# Altium project BugBuster_DAQ.PrjPcb (part 2 of 3)
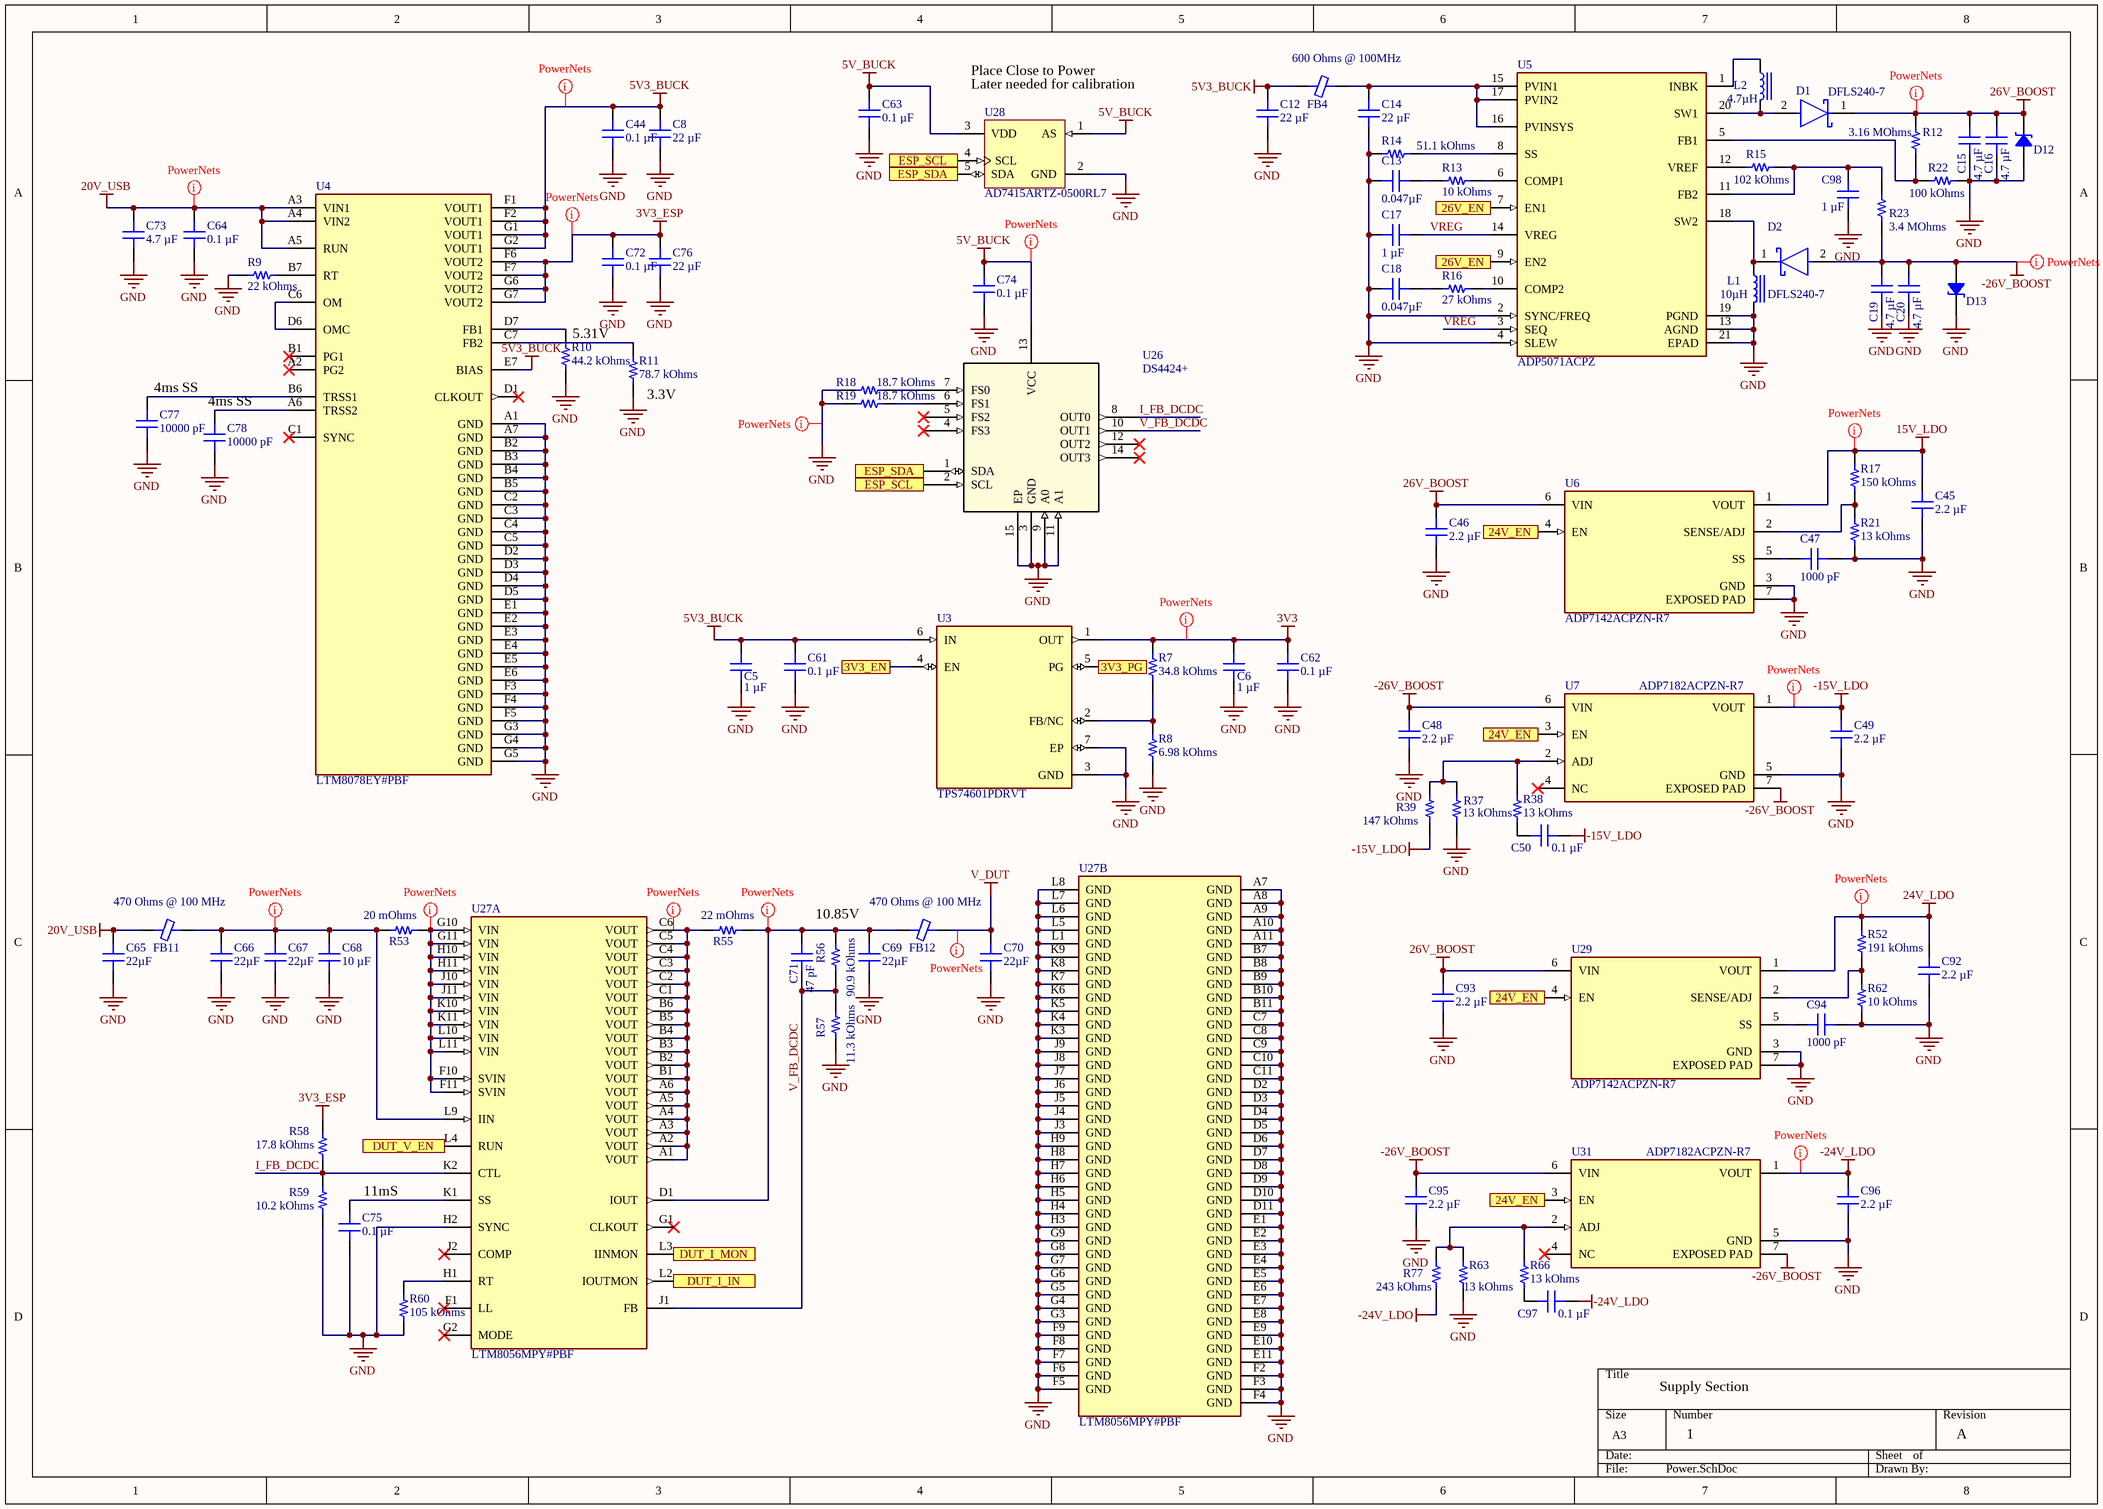
[diagram p6: Power.SchDoc]

## Sheet Power.SchDoc (continued)
### Library data of the parts
C5 C6 C17 C98 = GMC10X7R105M50NT: SMT Capacitor; manufacturer: Cal-Chip Electronics, Inc.; Temperature Coefficient: X7R; Tolerance: ±20%; Voltage - Rated: 50V; Part Number: GMC10X7R105M50NT; Applications: General Purpose; Capacitance: 1 µF; componentlink1description: Datasheet; componentlink1url: https://calchip.com/wp-content/uploads/2024/02/gmc_series-1.pdf; componentlink2description: DigiKey Link; componentlink2url: https://www.digikey.com/en/products/detail/cal-chip-electronics-inc/GMC10X7R105M50NT/25323876; Device Package: 0603 (1608 Metric); lastupdated: 06/04/2026 19:17:52; Lifecycle Status: Active; Minimum Order: 1; Mounting Type: Surface Mount, MLCC; Operating Temperature: -55°C ~ 125°C; Package / Case: 0603 (1608 Metric); packaging: TapeAndReel; partid: 65934; price: 0.06; series: GMC; Size / Dimension: 0.063" L x 0.031" W (1.60mm x 0.80mm); Supplier 1: DigiKey; Supplier Part Number 1: 4713-GMC10X7R105M50NTCT-ND; Thickness (Max): 0.037" (0.95mm); value: 1 µF
C8 C12 C14 C76 = GRM188C61C226ME01D: SMT Capacitor; manufacturer: Murata Electronics; Temperature Coefficient: X5S; Tolerance: ±20%; Voltage - Rated: 16V; Part Number: GRM188C61C226ME01D; value: 22 µF; Applications: General Purpose; Capacitance: 22 µF; componentlink1description: Datasheet; componentlink1url: https://search.murata.co.jp/Ceramy/image/img/A01X/G101/ENG/GRM188C61C226ME01-01A.pdf; componentlink2description: DigiKey Link; componentlink2url: https://www.digikey.com/en/products/detail/murata-electronics/GRM188C61C226ME01D/22528395; Device Package: 0603 (1608 Metric); lastupdated: 06/04/2026 19:18:15; Lifecycle Status: Active; Minimum Order: 1; Mounting Type: Surface Mount, MLCC; Operating Temperature: -55°C ~ 85°C; Package / Case: 0603 (1608 Metric); packaging: TapeAndReel; partid: 60294; price: 0.08; series: GRM; Size / Dimension: 0.063" L x 0.031" W (1.60mm x 0.80mm); Supplier 1: DigiKey; Supplier Part Number 1: 490-GRM188C61C226ME01DCT-ND; Thickness (Max): 0.039" (1.00mm)
C13 C18 = C0603C473K3RACAUTO: CAP CER 0.047UF 25V X7R 0603; manufacturer: KEMET; Capacitance: 0.047 ÂµF; Tolerance: Â±10%; Applications: Automotive Bypass Decoupling; componentlink1description: Datasheet; componentlink1url: https://api.kemet.com/component-edge/download/datasheet/C0603C473K3RACAUTO.pdf; componentlink2description: DigiKey Link; componentlink2url: https://www.digikey.com/en/products/detail/kemet/C0603C473K3RACAUTO/3314894; Device Package: 0603 (1608 Metric); lastupdated: 2026-04-06 19:23:51.997000; Lifecycle Status: Active; Part Number: C0603C473K3RACAUTO; Minimum Order: 1; Mounting Type: Surface Mount MLCC; Operating Temperature: -55Â°C ~ 125Â°C; Package / Case: 0603 (1608 Metric); packaging: TapeAndReel; partid: 2309; Part Status: Active; price: 0.01; Ratings: AEC-Q200; series: SMD Auto X7R; Size / Dimension: 0.063\ L x 0.031\ W (1.60mm x 0.80mm); Supplier 1: DigiKey; Supplier Part Number 1: 399-6899-1-ND; Temperature Coefficient: X7R; Thickness (Max): 0.035\ (0.90mm); value: 0.047µF; Voltage - Rated: 25V
C15 C16 C19 C20 = CGA4J1X7R1H475K125AC: CAP CER 4.7UF 50V X7R 0805; manufacturer: TDK Corporation; Tolerance: ±10%; Applications: Automotive; Capacitance: 4.7 µF; componentlink1description: Datasheet; componentlink1url: https://product.tdk.com/info/en/catalog/datasheets/mlcc_automotive_general_en.pdf?ref_disty=digikey; componentlink2description: DigiKey Link; componentlink2url: https://www.digikey.com/en/products/detail/tdk-corporation/CGA4J1X7R1H475K125AC/9742505; Device Package: 0805 (2012 Metric); Features: Low ESL; lastupdated: 2026-04-06 19:32:49.667000; Lifecycle Status: Active; Part Number: CGA4J1X7R1H475K125AC; Minimum Order: 1; Mounting Type: Surface Mount MLCC; Operating Temperature: -55°C ~ 125°C; Package / Case: 0805 (2012 Metric); packaging: TapeAndReel; partid: 44448; Part Status: Active; price: 0.12; Ratings: AEC-Q200; series: CGA; Size / Dimension: 0.079\ L x 0.049\ W (2.00mm x 1.25mm); Supplier 1: DigiKey; Supplier Part Number 1: 445-181404-1-ND; Temperature Coefficient: X7R; Thickness (Max): 0.059\ (1.50mm); value: 4.7 µF; Voltage - Rated: 50V
C44 C50 C61-C64 C72 C74 C75 C97 = C0603C104M5RACTU: SMT Capacitor; manufacturer: KEMET; Temperature Coefficient: X7R; Tolerance: ±20%; Voltage - Rated: 50V; Part Number: C0603C104M5RACTU; value: 0.1 µF; Applications: Bypass, Decoupling; Capacitance: 0.1 µF; componentlink1description: Datasheet; componentlink1url: https://api.kemet.com/component-edge/download/datasheet/C0603C104M5RACTU.pdf; componentlink2description: DigiKey Link; componentlink2url: https://www.digikey.com/en/products/detail/kemet/C0603C104M5RACTU/2199782; Device Package: 0603 (1608 Metric); lastupdated: 06/04/2026 19:22:47; Lifecycle Status: Active; Minimum Order: 1; Mounting Type: Surface Mount, MLCC; Operating Temperature: -55°C ~ 125°C; Package / Case: 0603 (1608 Metric); packaging: CutTape; partid: 69106; Part Status: Active; price: 0.01; series: SMD Comm X7R; Size / Dimension: 0.063" L x 0.031" W (1.60mm x 0.80mm); Supplier 1: DigiKey; Supplier Part Number 1: 399-C0603C104M5RACTUCT-ND; Thickness (Max): 0.034" (0.87mm)
C45 C46 C48 C49 C92 C93 C95 C96 = UMK212BB7225KG-T: SMT Capacitor; manufacturer: Taiyo Yuden; Temperature Coefficient: X7R; Tolerance: ±10%; Voltage - Rated: 50V; Part Number: UMK212BB7225KG-T; value: 2.2 µF; Applications: SMPS Filtering; Capacitance: 2.2 µF; componentlink1description: Datasheet; componentlink1url: https://www.yuden.co.jp/productdata/catalog/mlcc01_e.pdf; componentlink2description: DigiKey Link; componentlink2url: https://www.digikey.com/en/products/detail/taiyo-yuden/UMK212BB7225KG-T/3194965; Device Package: 0805 (2012 Metric); lastupdated: 06/04/2026 19:33:11; Lifecycle Status: Active; Minimum Order: 1; Mounting Type: Surface Mount, MLCC; Operating Temperature: -55°C ~ 125°C; Package / Case: 0805 (2012 Metric); packaging: TapeAndReel; partid: 45972; Part Status: Active; price: 0.06; series: M; Size / Dimension: 0.079" L x 0.049" W (2.00mm x 1.25mm); Supplier 1: DigiKey; Supplier Part Number 1: 587-3169-1-ND; Thickness (Max): 0.057" (1.45mm)
C47 C94 = GCJ188R71E102KA01D: CAP CER 1000PF 25V X7R 0603; manufacturer: Murata Electronics; Tolerance: ±10%; Applications: Automotive Boardflex Sensitive; Capacitance: 1000 pF; componentlink1description: Datasheet; componentlink1url: https://search.murata.co.jp/Ceramy/image/img/A01X/G101/ENG/GCJ188R71E102KA01-01.pdf; componentlink2description: DigiKey Link; componentlink2url: https://www.digikey.com/en/products/detail/murata-electronics/GCJ188R71E102KA01D/7363222; Device Package: 0603 (1608 Metric); Features: Soft Termination; lastupdated: 2026-04-06 19:23:52.667000; Lifecycle Status: Active; Part Number: GCJ188R71E102KA01D; Minimum Order: 1; Mounting Type: Surface Mount MLCC; Operating Temperature: -55°C ~ 125°C; Package / Case: 0603 (1608 Metric); packaging: TapeAndReel; partid: 2177; Part Status: Active; price: 0.01; Ratings: AEC-Q200; series: GCJ; Size / Dimension: 0.063\ L x 0.031\ W (1.60mm x 0.80mm); Supplier 1: DigiKey; Supplier Part Number 1: 490-16478-1-ND; Temperature Coefficient: X7R; Thickness (Max): 0.035\ (0.90mm); value: 1000 pF; Voltage - Rated: 25V
C65-C67 C69 C70 = CGA9P3X7R1H226M250KB: CAP 2220 X7R 50V 22UF 20% 2.50MM; manufacturer: TDK Corporation; Applications: Automotive; Capacitance: 22µF; componentlink1description: Datasheet; componentlink1url: https://product.tdk.com/info/en/catalog/datasheets/mlcc_automotive_general_en.pdf?ref_disty=digikey; componentlink2description: DigiKey Link; componentlink2url: http://digikey.com/product-detail/en/tdk-corporation/CGA9P3X7R1H226M250KB/445-181650-1-ND/10240637; Device Package: 2220 (5750 Metric); Features: Low ESL; lastupdated: 2020-09-02 01:11:23.223000; Lifecycle Status: Active; Part Number: CGA9P3X7R1H226M250KB; Minimum Order: 1; Mounting Type: Surface Mount MLCC; Operating Temperature: -55°C ~ 125°C; Package / Case: 2220 (5750 Metric); packaging: TapeAndReel; Part Status: Active; price: 5.78; Ratings: AEC-Q200; series: CGA; Size / Dimension: 0.224\ L x 0.197\ W (5.70mm x 5.00mm); Supplier 1: DigiKey; Supplier Part Number 1: 445-181650-1-ND; Temperature Coefficient: X7R; Thickness (Max): 0.110\ (2.80mm); Tolerance: ±20%; value: 22µF; Voltage - Rated: 50V
C68 = 1210B106K500CT: CAP CER 10UF 50V X7R 1210; manufacturer: Walsin Technology Corporation; Tolerance: ±10%; Applications: General Purpose; Capacitance: 10 µF; componentlink1description: Datasheet; componentlink1url: https://www.passivecomponent.com/wp-content/uploads/datasheet/WTC_MLCC_General_Purpose.pdf; componentlink2description: DigiKey Link; componentlink2url: https://www.digikey.com/en/products/detail/walsin-technology-corporation/1210B106K500CT/15987744; Device Package: 1210 (3225 Metric); lastupdated: 2026-04-06 19:45:06.543000; Lifecycle Status: Active; Part Number: 1210B106K500CT; Minimum Order: 1; Mounting Type: Surface Mount MLCC; Operating Temperature: -55°C ~ 125°C; Package / Case: 1210 (3225 Metric); packaging: TapeAndReel; partid: 78364; price: 0.07; series: -; Size / Dimension: 0.126\ L x 0.098\ W (3.20mm x 2.50mm); Supplier 1: DigiKey; Supplier Part Number 1: 1292-1210B106K500CT-ND; Temperature Coefficient: X7R; Thickness (Max): 0.110\ (2.80mm); value: 10 µF; Voltage - Rated: 50V
C71 = CC0603KRNPO9BN470: CAP CER 47PF 50V C0G/NPO 0603; manufacturer: Yageo; Temperature Coefficient: C0G NP0; Tolerance: ±10%; Applications: General Purpose; Capacitance: 47 pF; componentlink1description: Datasheet; componentlink1url: https://www.yageo.com/upload/media/product/productsearch/datasheet/mlcc/UPY-GP_NP0_16V-to-50V_17.pdf; componentlink2description: DigiKey Link; componentlink2url: https://www.digikey.com/en/products/detail/yageo/CC0603KRNPO9BN470/5883714; Device Package: 0603 (1608 Metric); lastupdated: 2026-04-06 19:23:26.303000; Lifecycle Status: Active; Part Number: CC0603KRNPO9BN470; Minimum Order: 1; Mounting Type: Surface Mount MLCC; Operating Temperature: -55°C ~ 125°C; Package / Case: 0603 (1608 Metric); packaging: TapeAndReel; partid: 9442; Part Status: Active; price: 0.01; series: CC; Size / Dimension: 0.063\ L x 0.031\ W (1.60mm x 0.80mm); Supplier 1: DigiKey; Supplier Part Number 1: 311-4037-1-ND; Thickness (Max): 0.035\ (0.90mm); value: 47 pF; Voltage - Rated: 50V
C73 = GRM21BZ7YA475KE15K: CAP CER 4.7UF 35V X7R 0805; manufacturer: Murata Electronics; Tolerance: ±10%; Applications: General Purpose; Capacitance: 4.7 µF; componentlink1description: Datasheet; componentlink1url: https://search.murata.co.jp/Ceramy/image/img/A01X/G101/ENG/GRM21BZ7YA475KE15-01.pdf; componentlink2description: DigiKey Link; componentlink2url: https://www.digikey.com/en/products/detail/murata-electronics/GRM21BZ7YA475KE15K/13904872; Device Package: 0805 (2012 Metric); lastupdated: 2026-04-06 19:31:47.907000; Lifecycle Status: Active; Part Number: GRM21BZ7YA475KE15K; Minimum Order: 1; Mounting Type: Surface Mount MLCC; Operating Temperature: -55°C ~ 125°C; Package / Case: 0805 (2012 Metric); packaging: TapeAndReel; partid: 42428; Part Status: Active; price: 0.05; series: GRM; Size / Dimension: 0.079\ L x 0.049\ W (2.00mm x 1.25mm); Supplier 1: DigiKey; Supplier Part Number 1: 490-GRM21BZ7YA475KE15KCT-ND; Temperature Coefficient: X7R; Thickness (Max): 0.057\ (1.45mm); value: 4.7 µF; Voltage - Rated: 35V
C77 C78 = AC0603KRX7R0BB103: CAP CER 10000PF 100V X7R 0603; manufacturer: Yageo; Tolerance: ±10%; Applications: Automotive; Capacitance: 10000 pF; componentlink1description: Datasheet; componentlink1url: http://www.yageo.com/NewPortal/_en/search/productDocs.jsp?YageoPartNumber=AC0603KRX7R0BB103; componentlink2description: DigiKey Link; componentlink2url: https://www.digikey.com/en/products/detail/yageo/AC0603KRX7R0BB103/6643086; Device Package: 0603 (1608 Metric); lastupdated: 2026-04-06 19:23:52.473000; Lifecycle Status: Active; Part Number: AC0603KRX7R0BB103; Minimum Order: 1; Mounting Type: Surface Mount MLCC; Operating Temperature: -55°C ~ 125°C; Package / Case: 0603 (1608 Metric); packaging: TapeAndReel; partid: 2218; Part Status: Active; price: 0.01; Ratings: AEC-Q200; series: AC; Size / Dimension: 0.063\ L x 0.031\ W (1.60mm x 0.80mm); Supplier 1: DigiKey; Supplier Part Number 1: 311-3100-1-ND; Temperature Coefficient: X7R; Thickness (Max): 0.035\ (0.90mm); value: 10000 pF; Voltage - Rated: 100V
D1 D2 = CMP-12790-000037-1: DIODE SCHOTTKY 40V 2A POWERDI123; Manufacturer: Diodes Inc.; Peak Reverse Current: 20uA; Max Junction Temp: +125°C; Capacitance: 28pF; Max Surge Forward Current: 40A; Value: 28pF; Digikey Description: DIODE SCHOTTKY 40V 2A POWERDI123; Lead Free: Yes; Temperature Range Low: -65°C; ComponentLink2Description: Datasheet; Height: 1mm; Max Repetitive Reverse Voltage: 40V; Forward Current: 2A; Mouser Description: Schottky Diodes & Rectifiers 2.0A 40V; RoHS: TRUE; Device Class L3: Schottky Diodes; Footprint Url: https://www.diodes.com/assets/Package-Files/PowerDI123.pdf; Reverse Voltage: 40V; Package: PowerDI123; Manufacturer Part Number: DFLS240-7; Automotive: No; Device Class L1: Discrete Semiconductors; Temperature: -65°C to +125°C; Octopart: https://octopart.com/dfls240-7-diodes+inc.-9289682; Category: Diode; Temperature Range High: +125°C; ComponentLink2URL: https://www.diodes.com/assets/Package-Files/PowerDI123.pdf; Device Class L2: Diodes
D12 D13 = BZT52C27-7-F: DIODE ZENER 27V 500MW SOD123; Manufacturer: Diodes Incorporated; Current - Reverse Leakage @ Vr: 100 nA @ 18.9 V; Impedance (Max) (Zzt): 80 Ohms; Tolerance: ±7%; Voltage - Forward (Vf) (Max) @ If: 900 mV @ 10 mA; Part Number: BZT52C27-7-F; ComponentLink1Description: Datasheet; ComponentLink1URL: https://www.diodes.com/assets/Datasheets/ds18004.pdf; ComponentLink2Description: DigiKey Link; ComponentLink2URL: https://www.digikey.com/en/products/detail/diodes-incorporated/BZT52C27-7-F/815014; LastUpdated: 05/04/2026 20:32:36; Lifecycle Status: Active; Minimum Order: 1; Mounting Type: Surface Mount; Operating Temperature: -65°C ~ 150°C; Package / Case: SOD-123; Packaging: TapeAndReel; PartId: 1914; Part Status: Active; Power - Max: 500 mW; Price: 0.02; Series: -; Supplier 1: DigiKey; Supplier Part Number 1: BZT52C27-FDICT-ND; Supplier Device Package: SOD-123; Voltage - Zener (Nom) (Vz): 27 V
FB4 = BBPY00201209601Y00: EMI BEAD FILETER; Manufacturer: Chilisin Electronics; Current Rating (Max): 2A; DC Resistance (DCR) (Max): 100mOhm; Number of Lines: 1; Part Number: BBPY00201209601Y00; ComponentLink1Description: Datasheet; ComponentLink1URL: https://www.chilisin.com/upload/media/product/emi_bead/file/BBPY_Series.pdf; ComponentLink2Description: DigiKey Link; ComponentLink2URL: http://digikey.com/product-detail/en/chilisin-electronics/BBPY00201209601Y00/2184-BBPY00201209601Y00CT-ND/10498864; Device Package: 0805 (2012 Metric); Impedance @ Frequency: 600 Ohms @ 100MHz; LastUpdated: 05/04/2026 20:28:59; Lifecycle Status: Active; Minimum Order: 1; Mounting Type: Surface Mount; Operating Temperature: -55°C ~ 125°C; Package / Case: 0805 (2012 Metric); Packaging: Unknown; PartId: 1846; Part Status: Active; Price: 0.02; Series: *; Supplier 1: DigiKey; Supplier Part Number 1: 2184-BBPY00201209601Y00CT-ND; Value: 600 Ohms @ 100MHz
FB11 FB12 = BLM31KN471SN1L: FERRITE BEAD 470 OHM 1206 1LN; Manufacturer: Murata Electronics; Current Rating (Max): 4A; DC Resistance (DCR) (Max): 20mOhm; Filter Type: Power Line; Number of Lines: 1; Part Number: BLM31KN471SN1L; ComponentLink1Description: Datasheet; ComponentLink1URL: https://www.murata.com/en-global/products/productdata/8796739698718/ENFA0006.pdf; ComponentLink2Description: DigiKey Link; ComponentLink2URL: https://www.digikey.com/en/products/detail/murata-electronics/BLM31KN471SN1L/7564095; Device Package: 1206 (3216 Metric); Height (Max): 0.071" (1.80mm); Impedance @ Frequency: 470 Ohms @ 100 MHz; LastUpdated: 05/04/2026 20:29:27; Lifecycle Status: Active; Minimum Order: 1; Mounting Type: Surface Mount; Operating Temperature: -55°C ~ 125°C; Package / Case: 1206 (3216 Metric); Packaging: TapeAndReel; PartId: 1689; Part Status: Active; Price: 0.10; Series: BLM; Size / Dimension: 0.126" L x 0.063" W (3.20mm x 1.60mm); Supplier 1: DigiKey; Supplier Part Number 1: 490-16530-1-ND; Value: 470 Ohms @ 100 MHz
L1 = DFE252010F-100M=P2: FIXED IND 10UH 900MA 600 MOHM; Manufacturer: Murata Electronics; Current - Saturation: 1.5A; DC Resistance (DCR): 600mOhm Max; Inductance Frequency - Test: 1MHz; Material - Core: Iron Powder; Shielding: Shielded; Tolerance: ±20%; Part Number: DFE252010F-100M=P2; ComponentLink1Description: Datasheet; ComponentLink1URL: https://search.murata.co.jp/Ceramy/image/img/P02/J(E)TE243A-0012_DFE252010F_reference.pdf; ComponentLink2Description: DigiKey Link; ComponentLink2URL: http://digikey.com/product-detail/en/murata-electronics/DFE252010F-100M=P2/490-13039-1-ND/5812751; Current Rating (Amps): 900mA; Device Package: 1008 (2520 Metric); Height - Seated (Max): 0.039" (1.00mm); Inductance: 10µH; LastUpdated: 02/09/2020 01:29:31; Lifecycle Status: Active; Minimum Order: 1; Mounting Type: Surface Mount; Operating Temperature: -40°C ~ 125°C; Package / Case: 1008 (2520 Metric); Packaging: TapeAndReel; PartId: 3494; Part Status: Active; Price: 0.23; Series: DFE252010F; Size / Dimension: 0.098" L x 0.079" W (2.50mm x 2.00mm); Supplier 1: DigiKey; Supplier Part Number 1: 490-13039-1-ND; Value: 10µH
L2 = LPWI252010S4R7T: FIXED IND 4.7UH 1.5A 245MOHM SMD; Manufacturer: Littelfuse Inc.; Current - Saturation: 1.6A; DC Resistance (DCR): 245mOhm Max; Inductance Frequency - Test: 1MHz; Material - Core: Metal Composite; Shielding: Shielded; Tolerance: ±20%; Type: Thin Film; Part Number: LPWI252010S4R7T; ComponentLink1Description: Datasheet; ComponentLink1URL: //media.digikey.com/pdf/Data%20Sheets/Littelfuse%20PDFs/LPWI_Series_Rev2019_Prelim.pdf; ComponentLink2Description: DigiKey Link; ComponentLink2URL: http://digikey.com/product-detail/en/littelfuse-inc/LPWI252010S4R7T/F12114CT-ND/9996689; Current Rating (Amps): 1.5A; Device Package: 1008 (2520 Metric); Height - Seated (Max): 0.039" (1.00mm); Inductance: 4.7µH; LastUpdated: 05/04/2026 21:02:38; Lifecycle Status: Active; Minimum Order: 1; Mounting Type: Surface Mount; Operating Temperature: -40°C ~ 125°C; Package / Case: 1008 (2520 Metric); Packaging: TapeAndReel; PartId: 3510; Part Status: Active; Price: 0.30; Series: LPWI; Size / Dimension: 0.098" L x 0.079" W (2.50mm x 2.00mm); Supplier 1: DigiKey; Supplier Part Number 1: F12114CT-ND; Supplier Device Package: 1008; Value: 4.7µH
R7 = ERJ-3EKF3482V: RES SMD 34.8K OHM 1% 1/10W 0603; Manufacturer: Panasonic Electronic Components; Power (Watts): 0.1W, 1/10W; Temperature Coefficient: ±100ppm/°C; Part Number: ERJ-3EKF3482V; Value: 34.8 kOhms; ComponentLink1Description: Datasheet; ComponentLink1URL: https://industrial.panasonic.com/cdbs/www-data/pdf/RDA0000/AOA0000C304.pdf; ComponentLink2Description: DigiKey Link; ComponentLink2URL: https://www.digikey.com/en/products/detail/panasonic-electronic-components/ERJ-3EKF3482V/196306; Composition: Thick Film; Device Package: 0603 (1608 Metric); Features: Automotive AEC-Q200; Height - Seated (Max): 0.022" (0.55mm); LastUpdated: 09/02/2024 20:42:15; Lifecycle Status: Active; Minimum Order: 1; Number of Terminations: 2; Operating Temperature: -55°C ~ 155°C; Package / Case: 0603 (1608 Metric); Packaging: CutTape; PartId: 24039; Part Status: Active; Price: 0.01; Ratings: AEC-Q200; Resistance: 34.8 kOhms; Series: ERJ-3EK; Size / Dimension: 0.063" L x 0.031" W (1.60mm x 0.80mm); Supplier 1: DigiKey; Supplier Part Number 1: P34.8KHCT-ND; Supplier Device Package: 0603; Tolerance: ±1%
R8 = ERJ-3EKF6981V: RES SMD 6.98K OHM 1% 1/10W 0603; Manufacturer: Panasonic Electronic Components; Power (Watts): 0.1W, 1/10W; Temperature Coefficient: ±100ppm/°C; Part Number: ERJ-3EKF6981V; ComponentLink1Description: Datasheet; ComponentLink1URL: https://industrial.panasonic.com/cdbs/www-data/pdf/RDA0000/AOA0000C304.pdf; ComponentLink2Description: DigiKey Link; ComponentLink2URL: https://www.digikey.com/en/products/detail/panasonic-electronic-components/ERJ-3EKF6981V/196424; Composition: Thick Film; Device Package: 0603 (1608 Metric); Features: Automotive AEC-Q200; Height - Seated (Max): 0.022" (0.55mm); LastUpdated: 09/02/2024 20:42:22; Lifecycle Status: Active; Minimum Order: 1; Number of Terminations: 2; Operating Temperature: -55°C ~ 155°C; Package / Case: 0603 (1608 Metric); Packaging: TapeAndReel; PartId: 23131; Part Status: Active; Price: 0.01; Ratings: AEC-Q200; Resistance: 6.98 kOhms; Series: ERJ-3EK; Size / Dimension: 0.063" L x 0.031" W (1.60mm x 0.80mm); Supplier 1: DigiKey; Supplier Part Number 1: P6.98KHCT-ND; Supplier Device Package: 0603; Tolerance: ±1%; Value: 6.98 kOhms
R9 = ERJ-3EKF2202V: RES SMD 22K OHM 1% 1/10W 0603; Manufacturer: Panasonic Electronic Components; Power (Watts): 0.1W 1/10W; Temperature Coefficient: ±100ppm/°C; ComponentLink1Description: Datasheet; ComponentLink1URL: https://industrial.panasonic.com/cdbs/www-data/pdf/RDA0000/AOA0000C304.pdf; ComponentLink2Description: DigiKey Link; ComponentLink2URL: https://www.digikey.com/en/products/detail/panasonic-electronic-components/ERJ-3EKF2202V/1746336; Composition: Thick Film; Device Package: 0603 (1608 Metric); Features: Automotive AEC-Q200; Height - Seated (Max): 0.022\ (0.55mm); LastUpdated: 2024-02-09 20:42:23.103000; Lifecycle Status: Active; Part Number: ERJ-3EKF2202V; Minimum Order: 1; Number of Terminations: 2; Operating Temperature: -55°C ~ 155°C; Package / Case: 0603 (1608 Metric); Packaging: TapeAndReel; PartId: 23051; Part Status: Active; Price: 0.01; Ratings: AEC-Q200; Resistance: 22 kOhms; Series: ERJ-3EK; Size / Dimension: 0.063\ L x 0.031\ W (1.60mm x 0.80mm); Supplier 1: DigiKey; Supplier Part Number 1: P22.0KHCT-ND; Supplier Device Package: 0603; Tolerance: ±1%; Value: 22 kOhms
R10 = ERJ-3EKF4422V: RES SMD 44.2K OHM 1% 1/10W 0603; Manufacturer: Panasonic Electronic Components; Power (Watts): 0.1W 1/10W; Temperature Coefficient: ±100ppm/°C; ComponentLink1Description: Datasheet; ComponentLink1URL: https://industrial.panasonic.com/cdbs/www-data/pdf/RDA0000/AOA0000C304.pdf; ComponentLink2Description: DigiKey Link; ComponentLink2URL: https://www.digikey.com/en/products/detail/panasonic-electronic-components/ERJ-3EKF4422V/196359; Composition: Thick Film; Device Package: 0603 (1608 Metric); Features: Automotive AEC-Q200; Height - Seated (Max): 0.022\ (0.55mm); LastUpdated: 2024-02-09 20:41:56.340000; Lifecycle Status: Active; Part Number: ERJ-3EKF4422V; Minimum Order: 1; Number of Terminations: 2; Operating Temperature: -55°C ~ 155°C; Package / Case: 0603 (1608 Metric); Packaging: TapeAndReel; PartId: 26081; Part Status: Active; Price: 0.01; Ratings: AEC-Q200; Resistance: 44.2 kOhms; Series: ERJ-3EK; Size / Dimension: 0.063\ L x 0.031\ W (1.60mm x 0.80mm); Supplier 1: DigiKey; Supplier Part Number 1: P44.2KHCT-ND; Supplier Device Package: 0603; Tolerance: ±1%; Value: 44.2 kOhms
R11 = ERJ-3EKF7872V: RES SMD 78.7K OHM 1% 1/10W 0603; Manufacturer: Panasonic Electronic Components; Power (Watts): 0.1W 1/10W; Temperature Coefficient: ±100ppm/°C; ComponentLink1Description: Datasheet; ComponentLink1URL: https://industrial.panasonic.com/cdbs/www-data/pdf/RDA0000/AOA0000C304.pdf; ComponentLink2Description: DigiKey Link; ComponentLink2URL: https://www.digikey.com/en/products/detail/panasonic-electronic-components/ERJ-3EKF7872V/196479; Composition: Thick Film; Device Package: 0603 (1608 Metric); Features: Automotive AEC-Q200; Height - Seated (Max): 0.022\ (0.55mm); LastUpdated: 2024-02-09 20:41:56.970000; Lifecycle Status: Active; Part Number: ERJ-3EKF7872V; Minimum Order: 1; Number of Terminations: 2; Operating Temperature: -55°C ~ 155°C; Package / Case: 0603 (1608 Metric); Packaging: TapeAndReel; PartId: 26003; Part Status: Active; Price: 0.01; Ratings: AEC-Q200; Resistance: 78.7 kOhms; Series: ERJ-3EK; Size / Dimension: 0.063\ L x 0.031\ W (1.60mm x 0.80mm); Supplier 1: DigiKey; Supplier Part Number 1: P78.7KHCT-ND; Supplier Device Package: 0603; Tolerance: ±1%; Value: 78.7 kOhms
R12 = RMCF0603FT3M16: RES 3.16M OHM 1% 1/10W 0603; Manufacturer: Stackpole Electronics Inc; Power (Watts): 0.1W, 1/10W; Temperature Coefficient: ±200ppm/°C; Part Number: RMCF0603FT3M16; Value: 3.16 MOhms; ComponentLink1Description: Datasheet; ComponentLink1URL: https://www.seielect.com/catalog/sei-rmcf_rmcp.pdf; ComponentLink2Description: DigiKey Link; ComponentLink2URL: http://digikey.com/product-detail/en/stackpole-electronics-inc/RMCF0603FT3M16/RMCF0603FT3M16CT-ND/7790140; Composition: Thick Film; Device Package: 0603 (1608 Metric); Features: Automotive AEC-Q200; Height - Seated (Max): 0.022" (0.55mm); LastUpdated: 09/02/2024 20:42:44; Lifecycle Status: Active; Minimum Order: 1; Number of Terminations: 2; Operating Temperature: -55°C ~ 155°C; Package / Case: 0603 (1608 Metric); Packaging: CutTape; PartId: 18356; Part Status: Active; Price: 0.10; Ratings: AEC-Q200; Resistance: 3.16 MOhms; Series: RMCF; Size / Dimension: 0.061" L x 0.031" W (1.55mm x 0.80mm); Supplier 1: DigiKey; Supplier Part Number 1: RMCF0603FT3M16CT-ND; Supplier Device Package: 0603; Tolerance: ±1%
R13 R62 = ERJ-PA3F1002V: RES SMD 10K OHM 1% 1/3W 0603; Manufacturer: Panasonic Electronic Components; Power (Watts): 0.333W 1/3W; Temperature Coefficient: Â±100ppm/Â°C; Tolerance: Â±1%; ComponentLink1Description: Datasheet; ComponentLink1URL: https://industrial.panasonic.com/cdbs/www-data/pdf/RDO0000/AOA0000C331.pdf; ComponentLink2Description: DigiKey Link; ComponentLink2URL: https://www.digikey.com/en/products/detail/panasonic-electronic-components/ERJ-PA3F1002V/5035849; Composition: Thick Film; Device Package: 0603 (1608 Metric); Features: Automotive AEC-Q200 Pulse Withstanding; Height - Seated (Max): 0.022\ (0.55mm); LastUpdated: 2024-02-09 20:42:57.847000; Lifecycle Status: Active; Part Number: ERJ-PA3F1002V; Minimum Order: 1; Number of Terminations: 2; Operating Temperature: -55Â°C ~ 155Â°C; Package / Case: 0603 (1608 Metric); Packaging: TapeAndReel; PartId: 14698; Part Status: Active; Price: 0.01; Ratings: AEC-Q200; Resistance: 10 kOhms; Series: ERJ-PA3; Size / Dimension: 0.063\ L x 0.031\ W (1.60mm x 0.80mm); Supplier 1: DigiKey; Supplier Part Number 1: P10KBYCT-ND; Supplier Device Package: 0603; Value: 10 kOhms
R14 = ERJ-3EKF5112V: RES SMD 51.1K OHM 1% 1/10W 0603; Manufacturer: Panasonic Electronic Components; Power (Watts): 0.1W 1/10W; Temperature Coefficient: ±100ppm/°C; ComponentLink1Description: Datasheet; ComponentLink1URL: https://industrial.panasonic.com/cdbs/www-data/pdf/RDA0000/AOA0000C304.pdf; ComponentLink2Description: DigiKey Link; ComponentLink2URL: https://www.digikey.com/en/products/detail/panasonic-electronic-components/ERJ-3EKF5112V/196391; Composition: Thick Film; Device Package: 0603 (1608 Metric); Features: Automotive AEC-Q200; Height - Seated (Max): 0.022\ (0.55mm); LastUpdated: 2024-02-09 20:42:22.343000; Lifecycle Status: Active; Part Number: ERJ-3EKF5112V; Minimum Order: 1; Number of Terminations: 2; Operating Temperature: -55°C ~ 155°C; Package / Case: 0603 (1608 Metric); Packaging: TapeAndReel; PartId: 23146; Part Status: Active; Price: 0.01; Ratings: AEC-Q200; Resistance: 51.1 kOhms; Series: ERJ-3EK; Size / Dimension: 0.063\ L x 0.031\ W (1.60mm x 0.80mm); Supplier 1: DigiKey; Supplier Part Number 1: P51.1KHCT-ND; Supplier Device Package: 0603; Tolerance: ±1%; Value: 51.1 kOhms
R15 = ERJ-3EKF1023V: RES SMD 102K OHM 1% 1/10W 0603; Manufacturer: Panasonic Electronic Components; Power (Watts): 0.1W 1/10W; Temperature Coefficient: Â±100ppm/Â°C; Tolerance: Â±1%; ComponentLink1Description: Datasheet; ComponentLink1URL: https://industrial.panasonic.com/cdbs/www-data/pdf/RDA0000/AOA0000C304.pdf; ComponentLink2Description: DigiKey Link; ComponentLink2URL: https://www.digikey.com/en/products/detail/panasonic-electronic-components/ERJ-3EKF1023V/196077; Composition: Thick Film; Device Package: 0603 (1608 Metric); Features: Automotive AEC-Q200; Height - Seated (Max): 0.022\ (0.55mm); LastUpdated: 2024-02-09 20:41:56.103000; Lifecycle Status: Active; Part Number: ERJ-3EKF1023V; Minimum Order: 1; Number of Terminations: 2; Operating Temperature: -55Â°C ~ 155Â°C; Package / Case: 0603 (1608 Metric); Packaging: TapeAndReel; PartId: 26109; Part Status: Active; Price: 0.01; Ratings: AEC-Q200; Resistance: 102 kOhms; Series: ERJ-3EK; Size / Dimension: 0.063\ L x 0.031\ W (1.60mm x 0.80mm); Supplier 1: DigiKey; Supplier Part Number 1: P102KHCT-ND; Supplier Device Package: 0603; Value: 102 kOhms
R16 = ERJ-PA3F2702V: RES SMD 27K OHM 1% 1/3W 0603; Manufacturer: Panasonic Electronic Components; Power (Watts): 0.333W 1/3W; Temperature Coefficient: Â±100ppm/Â°C; Tolerance: Â±1%; ComponentLink1Description: Datasheet; ComponentLink1URL: https://industrial.panasonic.com/cdbs/www-data/pdf/RDO0000/AOA0000C331.pdf; ComponentLink2Description: DigiKey Link; ComponentLink2URL: https://www.digikey.com/en/products/detail/panasonic-electronic-components/ERJ-PA3F2702V/5035900; Composition: Thick Film; Device Package: 0603 (1608 Metric); Features: Automotive AEC-Q200 Pulse Withstanding; Height - Seated (Max): 0.022\ (0.55mm); LastUpdated: 2024-02-09 20:42:50.500000; Lifecycle Status: Active; Part Number: ERJ-PA3F2702V; Minimum Order: 1; Number of Terminations: 2; Operating Temperature: -55Â°C ~ 155Â°C; Package / Case: 0603 (1608 Metric); Packaging: TapeAndReel; PartId: 16622; Part Status: Active; Price: 0.01; Ratings: AEC-Q200; Resistance: 27 kOhms; Series: ERJ-PA3; Size / Dimension: 0.063\ L x 0.031\ W (1.60mm x 0.80mm); Supplier 1: DigiKey; Supplier Part Number 1: P27KBYCT-ND; Supplier Device Package: 0603; Value: 27 kOhms
R17 = ERJ-PA3F1503V: RES SMD 150K OHM 1% 1/3W 0603; Manufacturer: Panasonic Electronic Components; Power (Watts): 0.333W 1/3W; Temperature Coefficient: ±100ppm/°C; ComponentLink1Description: Datasheet; ComponentLink1URL: https://industrial.panasonic.com/cdbs/www-data/pdf/RDO0000/AOA0000C331.pdf; ComponentLink2Description: DigiKey Link; ComponentLink2URL: https://www.digikey.com/en/products/detail/panasonic-electronic-components/ERJ-PA3F1503V/5035871; Composition: Thick Film; Device Package: 0603 (1608 Metric); Features: Automotive AEC-Q200 Pulse Withstanding; Height - Seated (Max): 0.022\ (0.55mm); LastUpdated: 2024-02-09 20:42:57.170000; Lifecycle Status: Active; Part Number: ERJ-PA3F1503V; Minimum Order: 1; Number of Terminations: 2; Operating Temperature: -55°C ~ 155°C; Package / Case: 0603 (1608 Metric); Packaging: TapeAndReel; PartId: 14896; Part Status: Active; Price: 0.01; Ratings: AEC-Q200; Resistance: 150 kOhms; Series: ERJ-PA3; Size / Dimension: 0.063\ L x 0.031\ W (1.60mm x 0.80mm); Supplier 1: DigiKey; Supplier Part Number 1: P150KBYCT-ND; Supplier Device Package: 0603; Tolerance: ±1%; Value: 150 kOhms
R18 R19 = ERJ-3EKF1872V: RES SMD 18.7K OHM 1% 1/10W 0603; Manufacturer: Panasonic Electronic Components; Power (Watts): 0.1W 1/10W; Temperature Coefficient: ±100ppm/°C; ComponentLink1Description: Datasheet; ComponentLink1URL: https://industrial.panasonic.com/cdbs/www-data/pdf/RDA0000/AOA0000C304.pdf; ComponentLink2Description: DigiKey Link; ComponentLink2URL: https://www.digikey.com/en/products/detail/panasonic-electronic-components/ERJ-3EKF1872V/196169; Composition: Thick Film; Device Package: 0603 (1608 Metric); Features: Automotive AEC-Q200; Height - Seated (Max): 0.022\ (0.55mm); LastUpdated: 2024-02-09 20:42:13.710000; Lifecycle Status: Active; Part Number: ERJ-3EKF1872V; Minimum Order: 1; Number of Terminations: 2; Operating Temperature: -55°C ~ 155°C; Package / Case: 0603 (1608 Metric); Packaging: TapeAndReel; PartId: 24162; Part Status: Active; Price: 0.01; Ratings: AEC-Q200; Resistance: 18.7 kOhms; Series: ERJ-3EK; Size / Dimension: 0.063\ L x 0.031\ W (1.60mm x 0.80mm); Supplier 1: DigiKey; Supplier Part Number 1: P18.7KHCT-ND; Supplier Device Package: 0603; Tolerance: ±1%; Value: 18.7 kOhms
R21 R37 R38 R63 R66 = ERJ-PA3F1302V: RES SMD 13K OHM 1% 1/3W 0603; Manufacturer: Panasonic Electronic Components; Power (Watts): 0.333W 1/3W; Temperature Coefficient: ±100ppm/°C; ComponentLink1Description: Datasheet; ComponentLink1URL: https://industrial.panasonic.com/cdbs/www-data/pdf/RDO0000/AOA0000C331.pdf; ComponentLink2Description: DigiKey Link; ComponentLink2URL: https://www.digikey.com/en/products/detail/panasonic-electronic-components/ERJ-PA3F1302V/5035865; Composition: Thick Film; Device Package: 0603 (1608 Metric); Features: Automotive AEC-Q200 Pulse Withstanding; Height - Seated (Max): 0.022\ (0.55mm); LastUpdated: 2024-02-09 20:42:19.180000; Lifecycle Status: Active; Part Number: ERJ-PA3F1302V; Minimum Order: 1; Number of Terminations: 2; Operating Temperature: -55°C ~ 155°C; Package / Case: 0603 (1608 Metric); Packaging: TapeAndReel; PartId: 23525; Part Status: Active; Price: 0.01; Ratings: AEC-Q200; Resistance: 13 kOhms; Series: ERJ-PA3; Size / Dimension: 0.063\ L x 0.031\ W (1.60mm x 0.80mm); Supplier 1: DigiKey; Supplier Part Number 1: P13KBYCT-ND; Supplier Device Package: 0603; Tolerance: ±1%; Value: 13 kOhms
R22 = ERJ-PA3F1003V: RES SMD 100K OHM 1% 1/3W 0603; Manufacturer: Panasonic Electronic Components; Power (Watts): 0.333W 1/3W; Temperature Coefficient: Â±100ppm/Â°C; Tolerance: Â±1%; ComponentLink1Description: Datasheet; ComponentLink1URL: https://industrial.panasonic.com/cdbs/www-data/pdf/RDO0000/AOA0000C331.pdf; ComponentLink2Description: DigiKey Link; ComponentLink2URL: https://www.digikey.com/en/products/detail/panasonic-electronic-components/ERJ-PA3F1003V/5035850; Composition: Thick Film; Device Package: 0603 (1608 Metric); Features: Automotive AEC-Q200 Pulse Withstanding; Height - Seated (Max): 0.022\ (0.55mm); LastUpdated: 2024-02-09 20:42:57.243000; Lifecycle Status: Active; Part Number: ERJ-PA3F1003V; Minimum Order: 1; Number of Terminations: 2; Operating Temperature: -55Â°C ~ 155Â°C; Package / Case: 0603 (1608 Metric); Packaging: TapeAndReel; PartId: 14879; Part Status: Active; Price: 0.01; Ratings: AEC-Q200; Resistance: 100 kOhms; Series: ERJ-PA3; Size / Dimension: 0.063\ L x 0.031\ W (1.60mm x 0.80mm); Supplier 1: DigiKey; Supplier Part Number 1: P100KBYCT-ND; Supplier Device Package: 0603; Value: 100 kOhms
R23 = RMCF0603FT3M40: RES 3.4M OHM 1% 1/10W 0603; Manufacturer: Stackpole Electronics Inc; Power (Watts): 0.1W 1/10W; Temperature Coefficient: Â±200ppm/Â°C; Tolerance: Â±1%; ComponentLink1Description: Datasheet; ComponentLink1URL: https://www.seielect.com/catalog/sei-rmcf_rmcp.pdf; ComponentLink2Description: DigiKey Link; ComponentLink2URL: https://www.digikey.com/en/products/detail/stackpole-electronics-inc/RMCF0603FT3M40/6266826; Composition: Thick Film; Device Package: 0603 (1608 Metric); Features: Automotive AEC-Q200; Height - Seated (Max): 0.022\ (0.55mm); LastUpdated: 2024-02-09 20:43:22.613000; Lifecycle Status: Active; Part Number: RMCF0603FT3M40; Minimum Order: 1; Number of Terminations: 2; Operating Temperature: -55Â°C ~ 155Â°C; Package / Case: 0603 (1608 Metric); Packaging: CutTape; PartId: 8347; Part Status: Active; Price: 0.01; Ratings: AEC-Q200; Resistance: 3.4 MOhms; Series: RMCF; Size / Dimension: 0.061\ L x 0.031\ W (1.55mm x 0.80mm); Supplier 1: DigiKey; Supplier Part Number 1: RMCF0603FT3M40CT-ND; Supplier Device Package: 0603; Value: 3.4 MOhms
R39 = ERJ-3EKF1473V: RES SMD 147K OHM 1% 1/10W 0603; Manufacturer: Panasonic Electronic Components; Power (Watts): 0.1W 1/10W; Temperature Coefficient: ±100ppm/°C; ComponentLink1Description: Datasheet; ComponentLink1URL: https://industrial.panasonic.com/cdbs/www-data/pdf/RDA0000/AOA0000C304.pdf; ComponentLink2Description: DigiKey Link; ComponentLink2URL: https://www.digikey.com/en/products/detail/panasonic-electronic-components/ERJ-3EKF1473V/196131; Composition: Thick Film; Device Package: 0603 (1608 Metric); Features: Automotive AEC-Q200; Height - Seated (Max): 0.022\ (0.55mm); LastUpdated: 2024-02-09 20:42:14.433000; Lifecycle Status: Active; Part Number: ERJ-3EKF1473V; Minimum Order: 1; Number of Terminations: 2; Operating Temperature: -55°C ~ 155°C; Package / Case: 0603 (1608 Metric); Packaging: TapeAndReel; PartId: 24063; Part Status: Active; Price: 0.01; Ratings: AEC-Q200; Resistance: 147 kOhms; Series: ERJ-3EK; Size / Dimension: 0.063\ L x 0.031\ W (1.60mm x 0.80mm); Supplier 1: DigiKey; Supplier Part Number 1: P147KHCT-ND; Supplier Device Package: 0603; Tolerance: ±1%; Value: 147 kOhms
R52 = ERJ-3EKF1913V: RES SMD 191K OHM 1% 1/10W 0603; Manufacturer: Panasonic Electronic Components; Power (Watts): 0.1W 1/10W; Temperature Coefficient: Â±100ppm/Â°C; Tolerance: Â±1%; ComponentLink1Description: Datasheet; ComponentLink1URL: https://industrial.panasonic.com/cdbs/www-data/pdf/RDA0000/AOA0000C304.pdf; ComponentLink2Description: DigiKey Link; ComponentLink2URL: https://www.digikey.com/en/products/detail/panasonic-electronic-components/ERJ-3EKF1913V/196180; Composition: Thick Film; Device Package: 0603 (1608 Metric); Features: Automotive AEC-Q200; Height - Seated (Max): 0.022\ (0.55mm); LastUpdated: 2024-02-09 20:42:13.417000; Lifecycle Status: Active; Part Number: ERJ-3EKF1913V; Minimum Order: 1; Number of Terminations: 2; Operating Temperature: -55Â°C ~ 155Â°C; Package / Case: 0603 (1608 Metric); Packaging: TapeAndReel; PartId: 24201; Part Status: Active; Price: 0.01; Ratings: AEC-Q200; Resistance: 191 kOhms; Series: ERJ-3EK; Size / Dimension: 0.063\ L x 0.031\ W (1.60mm x 0.80mm); Supplier 1: DigiKey; Supplier Part Number 1: P191KHCT-ND; Supplier Device Package: 0603; Value: 191 kOhms
R53 = ERJ-8BWFR020V: RES 0.02 OHM 1% 1W 1206; Manufacturer: Panasonic Electronic Components; Temperature Coefficient: 0/ +150ppm/°C; Part Number: ERJ-8BWFR020V; ComponentLink1Description: Datasheet; ComponentLink1URL: https://industrial.panasonic.com/cdbs/www-data/pdf/RDN0000/AOA0000C313.pdf; ComponentLink2Description: DigiKey Link; ComponentLink2URL: https://www.digikey.com/en/products/detail/panasonic-electronic-components/ERJ-8BWFR020V/1711639; Composition: Thick Film; Device Package: 1206 (3216 Metric); Features: Automotive AEC-Q200, Current Sense; Height - Seated (Max): 0.030" (0.75mm); LastUpdated: 05/04/2026 20:25:39; Lifecycle Status: Active; Minimum Order: 1; Number of Terminations: 2; Operating Temperature: -55°C ~ 155°C; Package / Case: 1206 (3216 Metric); Packaging: TapeAndReel; PartId: 2547; Part Status: Active; Power (Watts): 1W; Price: 0.18; Ratings: AEC-Q200; Resistance: 20 mOhms; Series: ERJ-8BW; Size / Dimension: 0.126" L x 0.063" W (3.20mm x 1.60mm); Supplier 1: DigiKey; Supplier Part Number 1: P.020AUCT-ND; Supplier Device Package: 1206; Tolerance: ±1%; Value: 20 mOhms
R55 = ERJ-D2DFR022V: RES 0.022 OHM 1W 1206 WIDE; Manufacturer: Panasonic Electronic Components; Temperature Coefficient: ±100ppm/°C; Tolerance: ±1%; Part Number: ERJ-D2DFR022V; ComponentLink1Description: Datasheet; ComponentLink1URL: https://industrial.panasonic.com/cdbs/www-data/pdf/RDN0000/RDN0000C331.pdf; ComponentLink2Description: DigiKey Link; ComponentLink2URL: https://www.digikey.com/en/products/detail/panasonic-electronic-components/ERJ-D2DFR022V/9948175; Composition: Thick Film; Device Package: 1206 (3216 Metric); Features: Automotive AEC-Q200, Current Sense; Height - Seated (Max): 0.031" (0.80mm); LastUpdated: 05/04/2026 20:25:34; Lifecycle Status: Active; Minimum Order: 1; Number of Terminations: 2; Operating Temperature: -55°C ~ 155°C; Package / Case: 1206 (3216 Metric); Packaging: TapeAndReel; PartId: 2866; Part Status: Active; Power (Watts): 1W; Price: 0.15; Ratings: AEC-Q200; Resistance: 22 mOhms; Series: ERJ-D2; Size / Dimension: 0.063" L x 0.126" W (1.60mm x 3.20mm); Supplier 1: DigiKey; Supplier Part Number 1: P124357CT-ND; Supplier Device Package: 0612; Value: 22 mOhms
R56 = ERJ-3EKF9092V: RES SMD 90.9K OHM 1% 1/10W 0603; Manufacturer: Panasonic Electronic Components; Power (Watts): 0.1W 1/10W; Temperature Coefficient: ±100ppm/°C; ComponentLink1Description: Datasheet; ComponentLink1URL: https://industrial.panasonic.com/cdbs/www-data/pdf/RDA0000/AOA0000C304.pdf; ComponentLink2Description: DigiKey Link; ComponentLink2URL: https://www.digikey.com/en/products/detail/panasonic-electronic-components/ERJ-3EKF9092V/196512; Composition: Thick Film; Device Package: 0603 (1608 Metric); Features: Automotive AEC-Q200; Height - Seated (Max): 0.022\ (0.55mm); LastUpdated: 2024-02-09 20:42:22.497000; Lifecycle Status: Active; Part Number: ERJ-3EKF9092V; Minimum Order: 1; Number of Terminations: 2; Operating Temperature: -55°C ~ 155°C; Package / Case: 0603 (1608 Metric); Packaging: TapeAndReel; PartId: 23128; Part Status: Active; Price: 0.01; Ratings: AEC-Q200; Resistance: 90.9 kOhms; Series: ERJ-3EK; Size / Dimension: 0.063\ L x 0.031\ W (1.60mm x 0.80mm); Supplier 1: DigiKey; Supplier Part Number 1: P90.9KHCT-ND; Supplier Device Package: 0603; Tolerance: ±1%; Value: 90.9 kOhms
R57 = ERJ-3EKF1132V: RES SMD 11.3K OHM 1% 1/10W 0603; Manufacturer: Panasonic Electronic Components; Power (Watts): 0.1W 1/10W; Temperature Coefficient: ±100ppm/°C; ComponentLink1Description: Datasheet; ComponentLink1URL: https://industrial.panasonic.com/cdbs/www-data/pdf/RDA0000/AOA0000C304.pdf; ComponentLink2Description: DigiKey Link; ComponentLink2URL: https://www.digikey.com/en/products/detail/panasonic-electronic-components/ERJ-3EKF1132V/196085; Composition: Thick Film; Device Package: 0603 (1608 Metric); Features: Automotive AEC-Q200; Height - Seated (Max): 0.022\ (0.55mm); LastUpdated: 2024-02-09 20:41:56.867000; Lifecycle Status: Active; Part Number: ERJ-3EKF1132V; Minimum Order: 1; Number of Terminations: 2; Operating Temperature: -55°C ~ 155°C; Package / Case: 0603 (1608 Metric); Packaging: TapeAndReel; PartId: 26019; Part Status: Active; Price: 0.01; Ratings: AEC-Q200; Resistance: 11.3 kOhms; Series: ERJ-3EK; Size / Dimension: 0.063\ L x 0.031\ W (1.60mm x 0.80mm); Supplier 1: DigiKey; Supplier Part Number 1: P11.3KHCT-ND; Supplier Device Package: 0603; Tolerance: ±1%; Value: 11.3 kOhms
R58 = ERJ-3EKF1782V: RES SMD 17.8K OHM 1% 1/10W 0603; Manufacturer: Panasonic Electronic Components; Power (Watts): 0.1W 1/10W; Temperature Coefficient: ±100ppm/°C; ComponentLink1Description: Datasheet; ComponentLink1URL: https://industrial.panasonic.com/cdbs/www-data/pdf/RDA0000/AOA0000C304.pdf; ComponentLink2Description: DigiKey Link; ComponentLink2URL: https://www.digikey.com/en/products/detail/panasonic-electronic-components/ERJ-3EKF1782V/196161; Composition: Thick Film; Device Package: 0603 (1608 Metric); Features: Automotive AEC-Q200; Height - Seated (Max): 0.022\ (0.55mm); LastUpdated: 2024-02-09 20:42:07.707000; Lifecycle Status: Active; Part Number: ERJ-3EKF1782V; Minimum Order: 1; Number of Terminations: 2; Operating Temperature: -55°C ~ 155°C; Package / Case: 0603 (1608 Metric); Packaging: TapeAndReel; PartId: 24838; Part Status: Active; Price: 0.01; Ratings: AEC-Q200; Resistance: 17.8 kOhms; Series: ERJ-3EK; Size / Dimension: 0.063\ L x 0.031\ W (1.60mm x 0.80mm); Supplier 1: DigiKey; Supplier Part Number 1: P17.8KHCT-ND; Supplier Device Package: 0603; Tolerance: ±1%; Value: 17.8 kOhms
R59 = ERJ-3EKF1022V: RES SMD 10.2K OHM 1% 1/10W 0603; Manufacturer: Panasonic Electronic Components; Power (Watts): 0.1W 1/10W; Temperature Coefficient: ±100ppm/°C; ComponentLink1Description: Datasheet; ComponentLink1URL: https://industrial.panasonic.com/cdbs/www-data/pdf/RDA0000/AOA0000C304.pdf; ComponentLink2Description: DigiKey Link; ComponentLink2URL: https://www.digikey.com/en/products/detail/panasonic-electronic-components/ERJ-3EKF1022V/196068; Composition: Thick Film; Device Package: 0603 (1608 Metric); Features: Automotive AEC-Q200; Height - Seated (Max): 0.022\ (0.55mm); LastUpdated: 2024-02-09 20:41:56.830000; Lifecycle Status: Active; Part Number: ERJ-3EKF1022V; Minimum Order: 1; Number of Terminations: 2; Operating Temperature: -55°C ~ 155°C; Package / Case: 0603 (1608 Metric); Packaging: TapeAndReel; PartId: 26026; Part Status: Active; Price: 0.01; Ratings: AEC-Q200; Resistance: 10.2 kOhms; Series: ERJ-3EK; Size / Dimension: 0.063\ L x 0.031\ W (1.60mm x 0.80mm); Supplier 1: DigiKey; Supplier Part Number 1: P10.2KHCT-ND; Supplier Device Package: 0603; Tolerance: ±1%; Value: 10.2 kOhms
R60 = ERJ-3EKF1053V: RES SMD 105K OHM 1% 1/10W 0603; Manufacturer: Panasonic Electronic Components; Power (Watts): 0.1W 1/10W; Temperature Coefficient: ±100ppm/°C; ComponentLink1Description: Datasheet; ComponentLink1URL: https://industrial.panasonic.com/cdbs/www-data/pdf/RDA0000/AOA0000C304.pdf; ComponentLink2Description: DigiKey Link; ComponentLink2URL: https://www.digikey.com/en/products/detail/panasonic-electronic-components/ERJ-3EKF1053V/196079; Composition: Thick Film; Device Package: 0603 (1608 Metric); Features: Automotive AEC-Q200; Height - Seated (Max): 0.022\ (0.55mm); LastUpdated: 2024-02-09 20:42:07.593000; Lifecycle Status: Active; Part Number: ERJ-3EKF1053V; Minimum Order: 1; Number of Terminations: 2; Operating Temperature: -55°C ~ 155°C; Package / Case: 0603 (1608 Metric); Packaging: TapeAndReel; PartId: 24851; Part Status: Active; Price: 0.01; Ratings: AEC-Q200; Resistance: 105 kOhms; Series: ERJ-3EK; Size / Dimension: 0.063\ L x 0.031\ W (1.60mm x 0.80mm); Supplier 1: DigiKey; Supplier Part Number 1: P105KHCT-ND; Supplier Device Package: 0603; Tolerance: ±1%; Value: 105 kOhms
R77 = ERJ-3EKF2433V: RES SMD 243K OHM 1% 1/10W 0603; Manufacturer: Panasonic Electronic Components; Power (Watts): 0.1W 1/10W; Temperature Coefficient: ±100ppm/°C; ComponentLink1Description: Datasheet; ComponentLink1URL: https://industrial.panasonic.com/cdbs/www-data/pdf/RDA0000/AOA0000C304.pdf; ComponentLink2Description: DigiKey Link; ComponentLink2URL: https://www.digikey.com/en/products/detail/panasonic-electronic-components/ERJ-3EKF2433V/196238; Composition: Thick Film; Device Package: 0603 (1608 Metric); Features: Automotive AEC-Q200; Height - Seated (Max): 0.022\ (0.55mm); LastUpdated: 2024-02-09 20:41:56.083000; Lifecycle Status: Active; Part Number: ERJ-3EKF2433V; Minimum Order: 1; Number of Terminations: 2; Operating Temperature: -55°C ~ 155°C; Package / Case: 0603 (1608 Metric); Packaging: TapeAndReel; PartId: 26112; Part Status: Active; Price: 0.01; Ratings: AEC-Q200; Resistance: 243 kOhms; Series: ERJ-3EK; Size / Dimension: 0.063\ L x 0.031\ W (1.60mm x 0.80mm); Supplier 1: DigiKey; Supplier Part Number 1: P243KHCT-ND; Supplier Device Package: 0603; Tolerance: ±1%; Value: 243 kOhms
U3 = TPS74601PDRVT: 1-A, low-IQ, high-accuracy, adjustable ultra-low-dropout voltage regulator with power good & enable; MF: Texas Instruments; SnapEDA_Link: https://www.snapeda.com/parts/TPS74601PDRVT/Texas+Instruments/view-part/?ref=snap; Package: WSON-6 Texas Instruments; Value: *; MP: TPS74601PDRVT; Check_prices: https://www.snapeda.com/parts/TPS74601PDRVT/Texas+Instruments/view-part/?ref=eda
U4 = CMP-09139-000054-1: DUAL 40VIN, 3A SILENT SWITCR UMO
U5 = CMP-09139-000215-1: IC REG BST SEPIC ADJ DL 20LFCSP; Number of Outputs: 2; Min Input Voltage: 2.85V; Voltage - Output 2: -39V; Min Output Voltage: 1.6V; Operating Supply Voltage: 15V; Current - Output 2: 1.2A; Current - Output 1: 2A; Voltage - Output 1: 39V; Output Type: Adjustable; Topology: Boost; Switching Frequency: 2.4MHz; Synchronous Rectifier: No; REACH SVHC: No SVHC; Max Operating Temperature: 125°C; Lead Free: Contains Lead; Packaging: Tray; Contact Plating: Tin; Number of Pins: 20; Output Current: 2A; Mount: Surface Mount; Max Output Voltage: 39V; Min Operating Temperature: -40°C; RoHS Compliant: Yes; Max Input Voltage: 15V
U6 U29 = CMP-09138-000083-1: IC REG LIN POS ADJ 200MA 6LFCSP; Dropout Voltage: 200mV; Operating Supply Current: 180uA; Min Input Voltage: 2.7V; Min Current Limit: 250mA; Power Supply Rejection Ratio (PSRR): 50dB; Input Bias Current: 1uA; Number of Regulators: 1; Output Voltage: 39.8V; Max Input Voltage: 40V; Accuracy: 0.8%; Quiescent Current: 140uA; Polarity: Positive; Output Type: Adjustable; Lead Free: Contains Lead; Mount: Surface Mount; Contact Plating: Gold; Max Output Current: 200mA; Package Quantity: 3000; Number of Pins: 6; Packaging: Tape and Reel; Min Operating Temperature: -40°C; Max Operating Temperature: 125°C; Number of Outputs: 1; Output Current: 200mA; RoHS Compliant: Yes
U7 U31 = CMP-09138-000111-1: IC REG LIN NEG ADJ 200MA 6LFCSP; Dropout Voltage: 185mV; Accuracy: 1%; Polarity: Negative; Max Supply Current: -650uA; Number of Outputs: 1; Min Output Voltage: -2.7V; Quiescent Current: -850uA; Power Supply Rejection Ratio (PSRR): 45dB; Max Input Voltage: -28V; Max Output Current: -200mA; Max Output Voltage: -25.3V; Min Current Limit: 230mA; Output Type: Adjustable; Output Voltage: 27.8V; RoHS Compliant: Yes; Packaging: Tape and Reel; Number of Pins: 6; Contact Plating: Gold; Lead Free: Contains Lead; Mount: Surface Mount; Min Input Voltage: -2.7V; Min Operating Temperature: -40°C; Number of Regulators: 1; Output Current: 200mA; Max Operating Temperature: 125°C
U26 = DS4424: Two-/Four-Channel, IÂ²C, 7-Bit Sink/Source Current DAC; Manufacturer_Name: Analog Devices Inc; Manufacturer_Part_Number: ds4424n+; Copyright: Copyright (C) 2026 Ultra Librarian. All rights reserved.; RefDes: RefDes; Type: Type
U27 = LTM8056MPY#PBF: DC DC CONVERTER 1.2-48V; Max Input Voltage: 58V; Output Current: 4A; Number of Outputs: 1; Min Input Voltage: 5V; Topology: Buck-Boost; Output Voltage: 1.2V; Max Output Voltage: 48V; Switching Frequency: 800kHz; Max Operating Temperature: 125°C; Min Operating Temperature: -55°C; Number of Pins: 121; Length: 0.59inch; Width: 0.59inch; Min Output Voltage: 1.2V; Max Output Current: 4A; REACH SVHC: No SVHC; Packaging: Tray; Case/Package: BGA; Features: OTP; Mount: Surface Mount; RoHS Compliant: Yes; Height: 0.2inch; Voltage - Output 1: 48V